# Altium project PLC_V1.0.PrjPcb
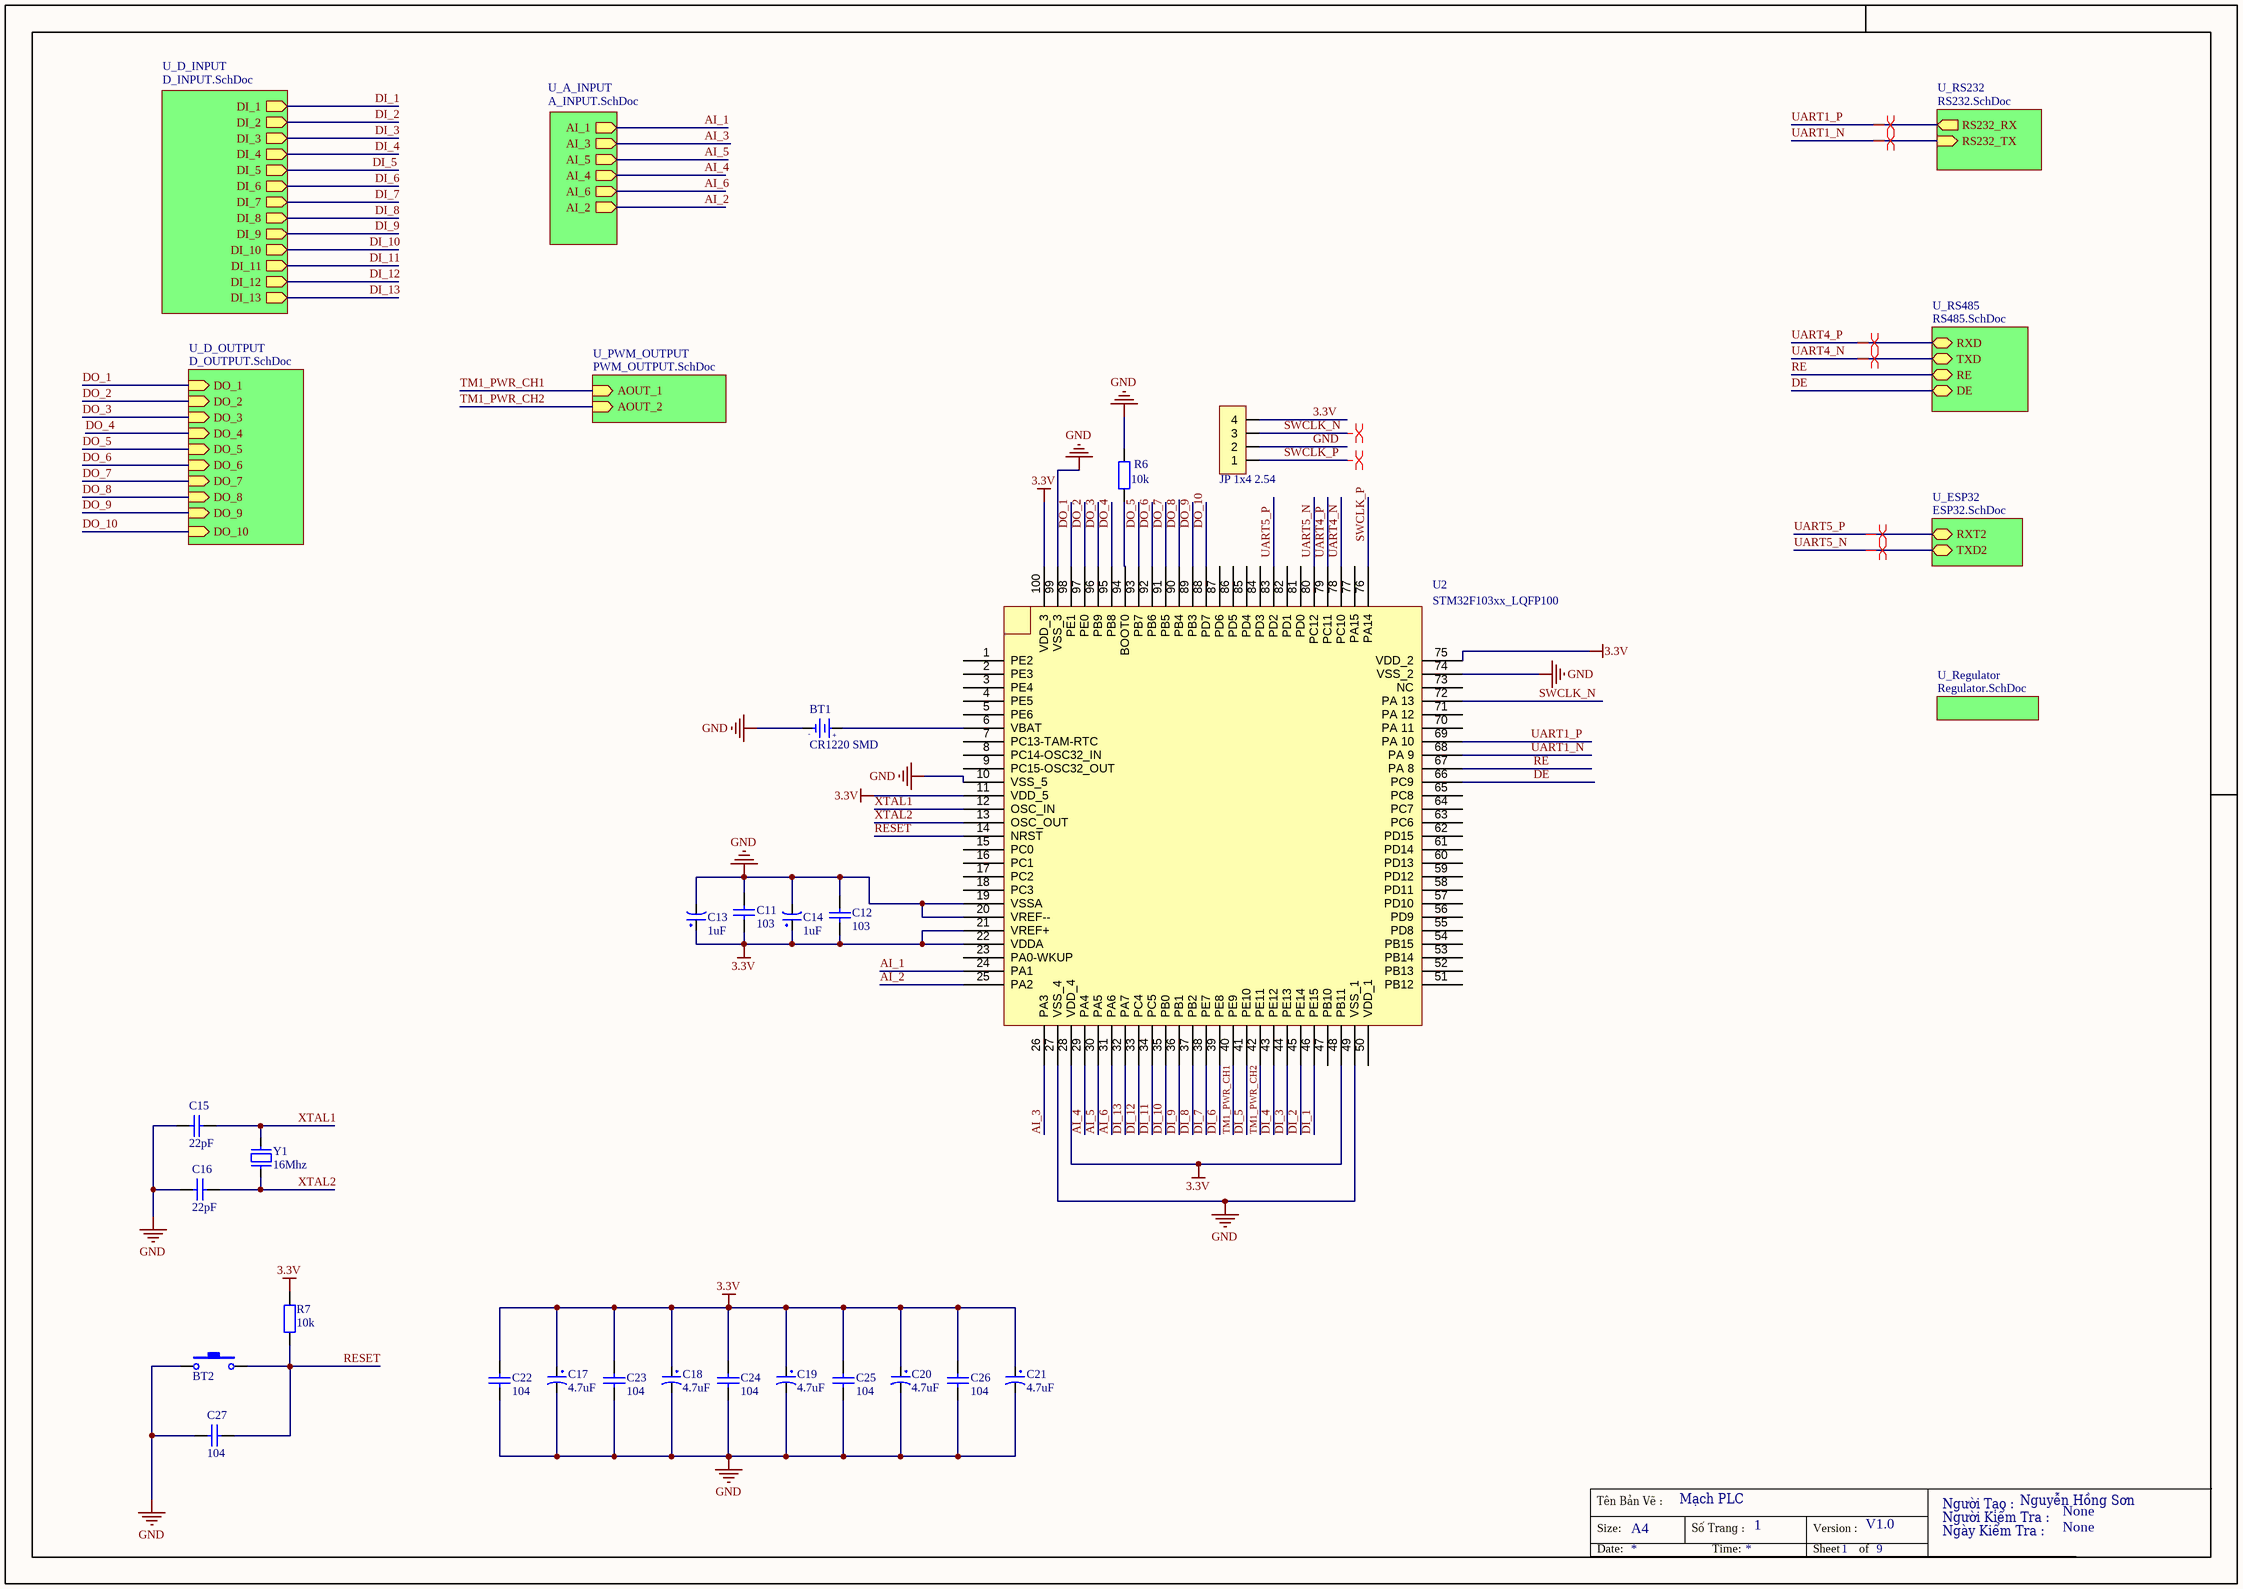
[diagram p0: PLC_V1.0.SchDoc]
9 sheets, 208 parts. Net scope: hierarchical (ports join the sheet entries above them; power ports are global).
Board file: PLC_V1.0.PcbDoc
Sheets:
  PLC_V1.0.SchDoc
    U_D_OUTPUT = D_OUTPUT.SchDoc
    U_RS485 = RS485.SchDoc
    U_D_INPUT = D_INPUT.SchDoc
    U_ESP32 = ESP32.SchDoc
    U_PWM_OUTPUT = PWM_OUTPUT.SchDoc
    U_A_INPUT = A_INPUT.SchDoc
    U_Regulator = Regulator.SchDoc
    U_RS232 = RS232.SchDoc

## Sheet PLC_V1.0.SchDoc: Mạch PLC
size 420 x 297 mm; SheetNumber: 1; SheetTotal: 9; Tên Bản Vẽ: Mạch PLC; Version: V1.0; Người Tạo: Nguyễn Hồng Sơn; Người Kiểm Tra: None; Ngày Kiểm Tra: None; Số Trang: 1

### Parts
BT1  CR1220 SMD  [DE PIN CR1220]
BT2  Nut Nhan 2 Chan SMD 3x6x2.5  [Nut Nhan 2 Chan SMD 3x6x2.5]  (value not drawn)
C11  103  [tu 0603]
C12  103  [tu 0603]
C13  1uF  [tu tantalum smd3216]
C14  1uF  [tu tantalum smd3216]
C15  22pF  [tu 0805]
C16  22pF  [tu 0805]
C17  4.7uF  [tu tantalum smd6032]
C18  4.7uF  [tu tantalum smd6032]
C19  4.7uF  [tu tantalum smd6032]
C20  4.7uF  [tu tantalum smd6032]
C21  4.7uF  [tu tantalum smd6032]
C22  104  [tu 0805]
C23  104  [tu 0805]
C24  104  [tu 0805]
C25  104  [tu 0805]
C26  104  [tu 0805]
C27  104  [tu 0805]
JP1  JP 1x4 2.54  [JP 1x4 DT]
R6  10k  [tro smd 0805]
R7  10k  [tro smd 0805]
U2  STM32F103xx_LQFP100  [STM32_LQFP100]
Y1  16Mhz  [Thach Anh 2 chan SMD]

### Sub-sheets
U_A_INPUT = A_INPUT.SchDoc: AI_1 (out), AI_3 (out), AI_5 (out), AI_4 (out), AI_6 (out), AI_2 (out)
U_D_INPUT = D_INPUT.SchDoc: DI_1 (out), DI_2 (out), DI_3 (out), DI_4 (out), DI_5 (out), DI_6 (out), DI_7 (out), DI_8 (out), DI_9 (out), DI_10 (out), DI_11 (out), DI_12 (out), DI_13 (out)
U_D_OUTPUT = D_OUTPUT.SchDoc: DO_1 (in), DO_2 (in), DO_3 (in), DO_4 (in), DO_5 (in), DO_6 (in), DO_7 (in), DO_8 (in), DO_9 (in), DO_10 (in)
U_ESP32 = ESP32.SchDoc: RXT2 (bidir), TXD2 (bidir)
U_PWM_OUTPUT = PWM_OUTPUT.SchDoc: AOUT_1 (in), AOUT_2 (in)
U_Regulator = Regulator.SchDoc: no entries
U_RS232 = RS232.SchDoc: RS232_RX (out), RS232_TX (in)
U_RS485 = RS485.SchDoc: RXD (bidir), TXD (bidir), RE (bidir), DE (bidir)

### Nets
3.3V: C11.1 C12.1 C13.1 C14.1 C17.1 C18.1 C19.1 C20.1 C21.1 C22.2 C23.2 C24.2 C25.2 C26.2 JP1.4 R7.1 U2.11(VDD_5) U2.21(VREF+) U2.22(VDDA) U2.28(VDD_4) U2.48(PB11) U2.75(VDD_2) U2.100(VDD_3)
GND: BT1.2(GND) BT2.1 C11.2 C12.2 C13.2 C14.2 C15.2 C16.2 C17.2 C18.2 C19.2 C20.2 C21.2 C22.1 C23.1 C24.1 C25.1 C26.1 C27.2 JP1.2 R6.2 U2.10(VSS_5) U2.19(VSSA) U2.20(VREF--) U2.27(VSS_4) U2.49(VSS_1) U2.74(VSS_2) U2.99(VSS_3)
AI_1: U2.24(PA1) ; sheet U_A_INPUT/AI_1
AI_2: U2.25(PA2) ; sheet U_A_INPUT/AI_2
AI_3: U2.26(PA3) ; sheet U_A_INPUT/AI_3
AI_4: U2.29(PA4) ; sheet U_A_INPUT/AI_4
AI_5: U2.30(PA5) ; sheet U_A_INPUT/AI_5
AI_6: U2.31(PA6) ; sheet U_A_INPUT/AI_6
DE: U2.66(PC9) ; sheet U_RS485/DE
DI_1: U2.46(PE15) ; sheet U_D_INPUT/DI_1
DI_2: U2.45(PE14) ; sheet U_D_INPUT/DI_2
DI_3: U2.44(PE13) ; sheet U_D_INPUT/DI_3
DI_4: U2.43(PE12) ; sheet U_D_INPUT/DI_4
DI_5: U2.41(PE10) ; sheet U_D_INPUT/DI_5
DI_6: U2.39(PE8) ; sheet U_D_INPUT/DI_6
DI_7: U2.38(PE7) ; sheet U_D_INPUT/DI_7
DI_8: U2.37(PB2) ; sheet U_D_INPUT/DI_8
DI_9: U2.36(PB1) ; sheet U_D_INPUT/DI_9
DI_10: U2.35(PB0) ; sheet U_D_INPUT/DI_10
DI_11: U2.34(PC5) ; sheet U_D_INPUT/DI_11
DI_12: U2.33(PC4) ; sheet U_D_INPUT/DI_12
DI_13: U2.32(PA7) ; sheet U_D_INPUT/DI_13
DO_1: U2.98(PE1) ; sheet U_D_OUTPUT/DO_1
DO_2: U2.97(PE0) ; sheet U_D_OUTPUT/DO_2
DO_3: U2.96(PB9) ; sheet U_D_OUTPUT/DO_3
DO_4: U2.95(PB8) ; sheet U_D_OUTPUT/DO_4
DO_5: U2.93(PB7) ; sheet U_D_OUTPUT/DO_5
DO_6: U2.92(PB6) ; sheet U_D_OUTPUT/DO_6
DO_7: U2.91(PB5) ; sheet U_D_OUTPUT/DO_7
DO_8: U2.90(PB4) ; sheet U_D_OUTPUT/DO_8
DO_9: U2.89(PB3) ; sheet U_D_OUTPUT/DO_9
DO_10: U2.88(PD7) ; sheet U_D_OUTPUT/DO_10
RE: U2.67(PA_8) ; sheet U_RS485/RE
RESET: BT2.2 C27.1 R7.2 U2.14(NRST)
SWCLK_N: JP1.3 U2.72(PA_13)
SWCLK_P: JP1.1 U2.76(PA14)
TM1_PWR_CH1: U2.40(PE9) ; sheet U_PWM_OUTPUT/AOUT_1
TM1_PWR_CH2: U2.42(PE11) ; sheet U_PWM_OUTPUT/AOUT_2
UART1_N: U2.68(PA_9) ; sheet U_RS232/RS232_TX
UART1_P: U2.69(PA_10) ; sheet U_RS232/RS232_RX
UART4_N: U2.78(PC10) ; sheet U_RS485/TXD
UART4_P: U2.79(PC11) ; sheet U_RS485/RXD
UART5_N: U2.80(PC12) ; sheet U_ESP32/TXD2
UART5_P: U2.83(PD2) ; sheet U_ESP32/RXT2
XTAL1: C15.1 U2.12(OSC_IN) Y1.2
XTAL2: C16.1 U2.13(OSC_OUT) Y1.1
NetBT1_1: BT1.1(+3V) U2.6(VBAT)
NetR6_1: R6.1 U2.94(BOOT0)

Not connected (* = marked no-connect by the designer): U2 1(PE2) 2(PE3) 3(PE4) 4(PE5) 5(PE6) 7(PC13-TAM-RTC) 8(PC14-OSC32_IN) 9(PC15-OSC32_OUT) 15(PC0) 16(PC1) 17(PC2) 18(PC3) 23(PA0-WKUP) 47(PB10) 50(VDD_1) 51(PB12) 52(PB13) 53(PB14) 54(PB15) 55(PD8) 56(PD9) 57(PD10) 58(PD11) 59(PD12) 60(PD13) 61(PD14) 62(PD15) 63(PC6) 64(PC7) 65(PC8) 70(PA_11) 71(PA_12) 73(NC) 77(PA15) 81(PD0) 82(PD1) 84(PD3) 85(PD4) 86(PD5) 87(PD6)

### Layout directives
differential pair: SWCLK_N, SWCLK_P, UART1_N, UART1_P, UART4_N, UART4_P, UART5_N, UART5_P

### Notes on the sheet
- Tên Bản Vẽ :
- Size:
- A4
- Số Trang :
- Version :
- Người Tạo :
- Người Kiểm Tra :
- Ngày Kiểm Tra :
- Date:
- Time:
- Sheet
- of
- (in symbol De pin CR1220 SMD) -; +

### Library data of the parts
BT1 = De pin CR1220 SMD: Ten: Đế PIN CR1220 SMD; Ma_Hang: MH000833
BT2 = Nut Nhan 2 Chan SMD 3x6x2.5: Ma_Hang: MH001036; Ten: Nút Nhấn 2 Chân 3x6x2.5MM SMD
C11 C12 = Tu 0603 103 50V 10%: Dán; Don_Vi: Con; So_Chan: 2; Ten_Linh_Kien: Tụ 0603 103-10nF 10% 50V; Ma_Hang: MH004567; Chung_Loai: Dán; Kieu_Chan: *
C13 C14 = Tu tantalum 1uF 25V SMD3216: Dán; Don_Vi: Con; So_Chan: 2; Ten_Linh_Kien: Tụ tantalum 105E-1uF 25V SMD3216; Ma_Hang: MH007472; Chung_Loai: Dán; Kieu_Chan: *
C15 C16 = Tu 0805 22pF 50V 10%: Dán; Don_Vi: Con; So_Chan: 2; Ten_Linh_Kien: Tụ 0805 22P 10% 50V; Ma_Hang: MH004560; Chung_Loai: Dán; Kieu_Chan: *
C17-C21 = Tu tantalum 4.7uF 35V SMD6032: Dán; Don_Vi: Con; So_Chan: 2; Ten_Linh_Kien: Tụ tantalum 475V-4.7uF 35V SMD6032; Ma_Hang: MH008687; Chung_Loai: Dán; Kieu_Chan: *
C22-C26 = Tu 0805 104 50V 10%: Dán 100nF; Don_Vi: Con; So_Chan: 2; Ten_Linh_Kien: Tụ 0805 104-100nF 10% 50V; Ma_Hang: MH004551; Chung_Loai: Dán; Kieu_Chan: *
  C22: Parameter 1: *
C27 = Tu 0805 104 50V 10%: Dán; Don_Vi: Con; So_Chan: 2; Ten_Linh_Kien: Tụ 0805 104-100nF 10% 50V; Ma_Hang: MH004551; Chung_Loai: Dán; Kieu_Chan: *
JP1 = JP 1x4 2.54 Duc Thang: Cắm; Ten_Linh_Kien: Jump Đơn Đực 2.54MM 1x40P Thẳng 11MM; Don_Vi: Con; Ma_Hang: MH000903; Ghi_Chu: *; Kieu_Chan: *; Chung_Loai: Cắm
R6 R7 = Tro 0805 5% 10k: Dán; Don_Vi: Con; So_Chan: 2; Ten_Linh_Kien: Trở 0805 5% 10k; Ma_Hang: MH005239; Chung_Loai: Dán; Kieu_Chan: *
Y1 = Thach Anh 2 chan SMD: Crystal For all Crystal 2pin.; Value: 4Mhz

## Sheet D_OUTPUT.SchDoc
size A; SheetNumber: 3; SheetTotal: 9
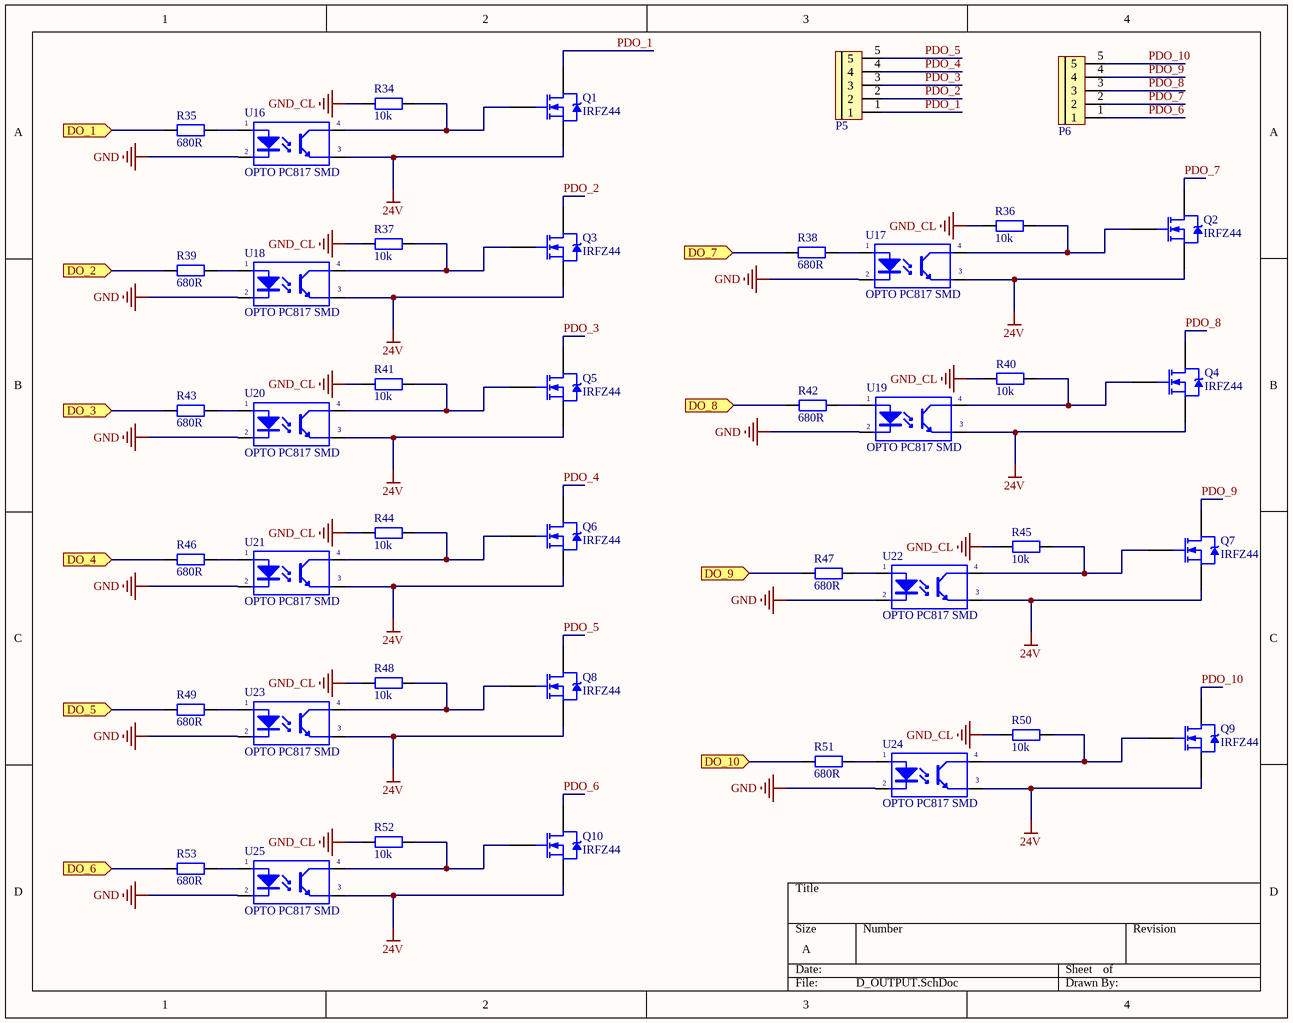
[diagram p1: D_OUTPUT.SchDoc]

### Parts
P5  CON 5 EDG5.08  [CON 5 5EDG5.08]  (value not drawn)
P6  CON 5 EDG5.08  [CON 5 5EDG5.08]  (value not drawn)
Q1  IRFZ44  [TO220]
Q2  IRFZ44  [TO220]
Q3  IRFZ44  [TO220]
Q4  IRFZ44  [TO220]
Q5  IRFZ44  [TO220]
Q6  IRFZ44  [TO220]
Q7  IRFZ44  [TO220]
Q8  IRFZ44  [TO220]
Q9  IRFZ44  [TO220]
Q10  IRFZ44  [TO220]
R34  10k  [tro smd 0805]
R35  680R  [Tro SMD 0805]
R36  10k  [tro smd 0805]
R37  10k  [tro smd 0805]
R38  680R  [Tro SMD 0805]
R39  680R  [Tro SMD 0805]
R40  10k  [tro smd 0805]
R41  10k  [tro smd 0805]
R42  680R  [Tro SMD 0805]
R43  680R  [Tro SMD 0805]
R44  10k  [tro smd 0805]
R45  10k  [tro smd 0805]
R46  680R  [Tro SMD 0805]
R47  680R  [Tro SMD 0805]
R48  10k  [tro smd 0805]
R49  680R  [Tro SMD 0805]
R50  10k  [tro smd 0805]
R51  680R  [Tro SMD 0805]
R52  10k  [tro smd 0805]
R53  680R  [Tro SMD 0805]
U16  OPTO PC817 SMD  [SOP4]
U17  OPTO PC817 SMD  [SOP4]
U18  OPTO PC817 SMD  [SOP4]
U19  OPTO PC817 SMD  [SOP4]
U20  OPTO PC817 SMD  [SOP4]
U21  OPTO PC817 SMD  [SOP4]
U22  OPTO PC817 SMD  [SOP4]
U23  OPTO PC817 SMD  [SOP4]
U24  OPTO PC817 SMD  [SOP4]
U25  OPTO PC817 SMD  [SOP4]

### Ports
DO_1 (in), DO_2 (in), DO_3 (in), DO_4 (in), DO_5 (in), DO_6 (in), DO_7 (in), DO_8 (in), DO_9 (in), DO_10 (in)

### Nets
24V: Q1.3(S) Q2.3(S) Q3.3(S) Q4.3(S) Q5.3(S) Q6.3(S) Q7.3(S) Q8.3(S) Q9.3(S) Q10.3(S) U16.3(E) U17.3(E) U18.3(E) U19.3(E) U20.3(E) U21.3(E) U22.3(E) U23.3(E) U24.3(E) U25.3(E)
GND: U16.2(K) U17.2(K) U18.2(K) U19.2(K) U20.2(K) U21.2(K) U22.2(K) U23.2(K) U24.2(K) U25.2(K)
GND_CL: R34.1 R36.1 R37.1 R40.1 R41.1 R44.1 R45.1 R48.1 R50.1 R52.1
DO_1: R35.1 ; port DO_1
DO_2: R39.1 ; port DO_2
DO_3: R43.1 ; port DO_3
DO_4: R46.1 ; port DO_4
DO_5: R49.1 ; port DO_5
DO_6: R53.1 ; port DO_6
DO_7: R38.1 ; port DO_7
DO_8: R42.1 ; port DO_8
DO_9: R47.1 ; port DO_9
DO_10: R51.1 ; port DO_10
PDO_1: P5.1 Q1.2(D)
PDO_2: P5.2 Q3.2(D)
PDO_3: P5.3 Q5.2(D)
PDO_4: P5.4 Q6.2(D)
PDO_5: P5.5 Q8.2(D)
PDO_6: P6.1 Q10.2(D)
PDO_7: P6.2 Q2.2(D)
PDO_8: P6.3 Q4.2(D)
PDO_9: P6.4 Q7.2(D)
PDO_10: P6.5 Q9.2(D)
NetQ1_1: Q1.1(G) R34.2 U16.4(C)
NetQ2_1: Q2.1(G) R36.2 U17.4(C)
NetQ3_1: Q3.1(G) R37.2 U18.4(C)
NetQ4_1: Q4.1(G) R40.2 U19.4(C)
NetQ5_1: Q5.1(G) R41.2 U20.4(C)
NetQ6_1: Q6.1(G) R44.2 U21.4(C)
NetQ7_1: Q7.1(G) R45.2 U22.4(C)
NetQ8_1: Q8.1(G) R48.2 U23.4(C)
NetQ9_1: Q9.1(G) R50.2 U24.4(C)
NetQ10_1: Q10.1(G) R52.2 U25.4(C)
NetR35_2: R35.2 U16.1(A)
NetR38_2: R38.2 U17.1(A)
NetR39_2: R39.2 U18.1(A)
NetR42_2: R42.2 U19.1(A)
NetR43_2: R43.2 U20.1(A)
NetR46_2: R46.2 U21.1(A)
NetR47_2: R47.2 U22.1(A)
NetR49_2: R49.2 U23.1(A)
NetR51_2: R51.2 U24.1(A)
NetR53_2: R53.2 U25.1(A)

### Library data of the parts
P5 P6 = CON 5 EDG5.08: Cắm; Ten_Linh_Kien: CON 5 2EDG5.08-5P 5.08MM ( Xanh Cong); Ma_Hang: MH003589; Kieu_Chan: *; Don_Vi: Con; Ghi_Chu: *; Chung_Loai: Cắm
Q1-Q10 = IRFZ44 DIP: N-Channel Power MOSFET
R34 R36 R37 R40 R41 R44 R45 R48 R50 R52 = Tro 0805 5% 10k: as R6 on sheet PLC_V1.0; Chung_Loai: Dán; Kieu_Chan: *
R35 R38 R39 R42 R43 R46 R47 R49 R51 R53 = Tro 0805 5% 680R: Dán; Don_Vi: Con; Ma_Hang: MH005344; So_Chan: 2; Ten_Linh_Kien: Trở 0805 5% 680R; Chung_Loai: Dán; Kieu_Chan: *
U16-U25 = OPTO PC817 SMD: Single Opto; Value: PC817

## Sheet RS485.SchDoc
size A; SheetNumber: 7; SheetTotal: 9
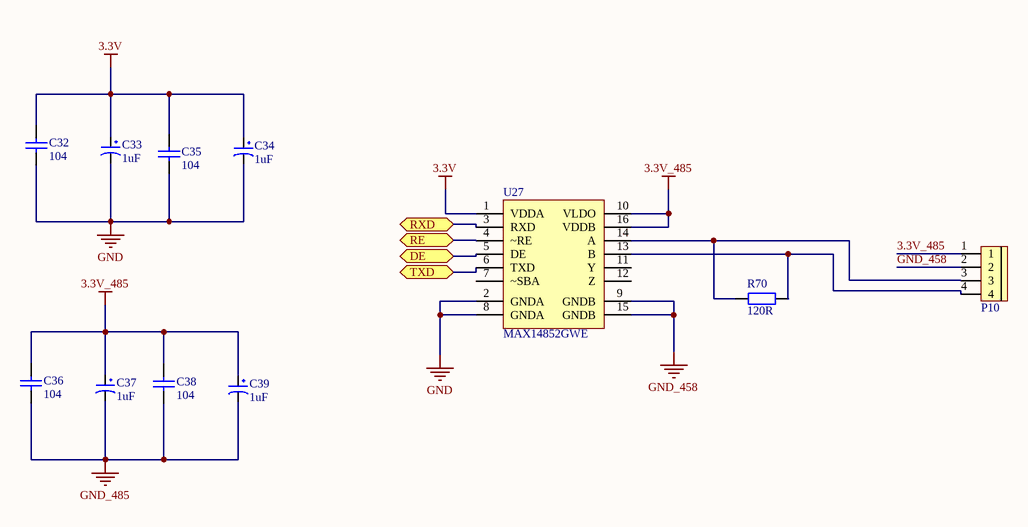
[diagram p2: RS485.SchDoc]

### Parts
C32  104  [tu 0805]
C33  1uF  [tu tantalum smd6032]
C34  1uF  [tu tantalum smd6032]
C35  104  [tu 0805]
C36  104  [tu 0805]
C37  1uF  [tu tantalum smd6032]
C38  104  [tu 0805]
C39  1uF  [tu tantalum smd6032]
P10  CON 4 EDG5.08  [CON 4 4EDG5.08]  (value not drawn)
R70  120R  [tro smd 0805]
U27  MAX14852GWE  [SOICW16_50_440_25X76_SMT]

### Ports
DE (bidir), RE (bidir), RXD (bidir), TXD (bidir)

### Nets
3.3V: C32.1 C33.1 C34.1 C35.1 U27.1(VDDA)
3.3V_485: C36.1 C37.1 C38.1 C39.1 P10.1 U27.10(VLDO) U27.16(VDDB)
GND: C32.2 C33.2 C34.2 C35.2 U27.2(GNDA) U27.8(GNDA)
GND_458: P10.2 U27.9(GNDB) U27.15(GNDB)
GND_485: C36.2 C37.2 C38.2 C39.2
DE: U27.5(DE) ; port DE
RE: U27.4(~RE) ; port RE
UART4_N: U27.6(TXD) ; port TXD
UART4_P: U27.3(RXD) ; port RXD
NetP10_3: P10.3 R70.1 U27.14(A)
NetP10_4: P10.4 R70.2 U27.13(B)

Not connected (* = marked no-connect by the designer): U27 7(~SBA) 11(Y) 12(Z)

### Library data of the parts
C32 C35 C36 C38 = Tu 0805 104 50V 10%: as C27 on sheet PLC_V1.0; Chung_Loai: Dán; Kieu_Chan: *
C33 C34 C37 C39 = Tu tantalum 1uF 50V SMD6032: Dán; Don_Vi: Con; So_Chan: 2; Ten_Linh_Kien: Tụ tantalum 105T-1uF 50V SMD6032; Ma_Hang: MH008400; Chung_Loai: Dán; Kieu_Chan: *
P10 = CON 4 EDG5.08: Cắm; Ten_Linh_Kien: CON 4 2EDG5.08-4P 5.08MM ( Xanh Cong); Ma_Hang: MH000979; Don_Vi: Con; Ghi_Chu: *; Kieu_Chan: *; Chung_Loai: Cắm
R70 = Tro 0805 5% 120R: Dán; Don_Vi: Con; So_Chan: 2; Ten_Linh_Kien: Trở 0805 5% 120R; Ma_Hang: MH005253; Chung_Loai: Dán; Kieu_Chan: *
U27 = IC_MAX14852GWE: 1/1 Transceiver Full RS422, RS485 16-SOIC; Manufacturer: Maxim; Manufacturer Part Number: MAX14852GWE+T; Alternate Part Number-1: NA; Case/Package: SOICW16; Supplier-1: Mouser; Supplier Part Number-1: 700-MAX14852GWE+T

## Sheet D_INPUT.SchDoc
size A; SheetNumber: 2; SheetTotal: 9
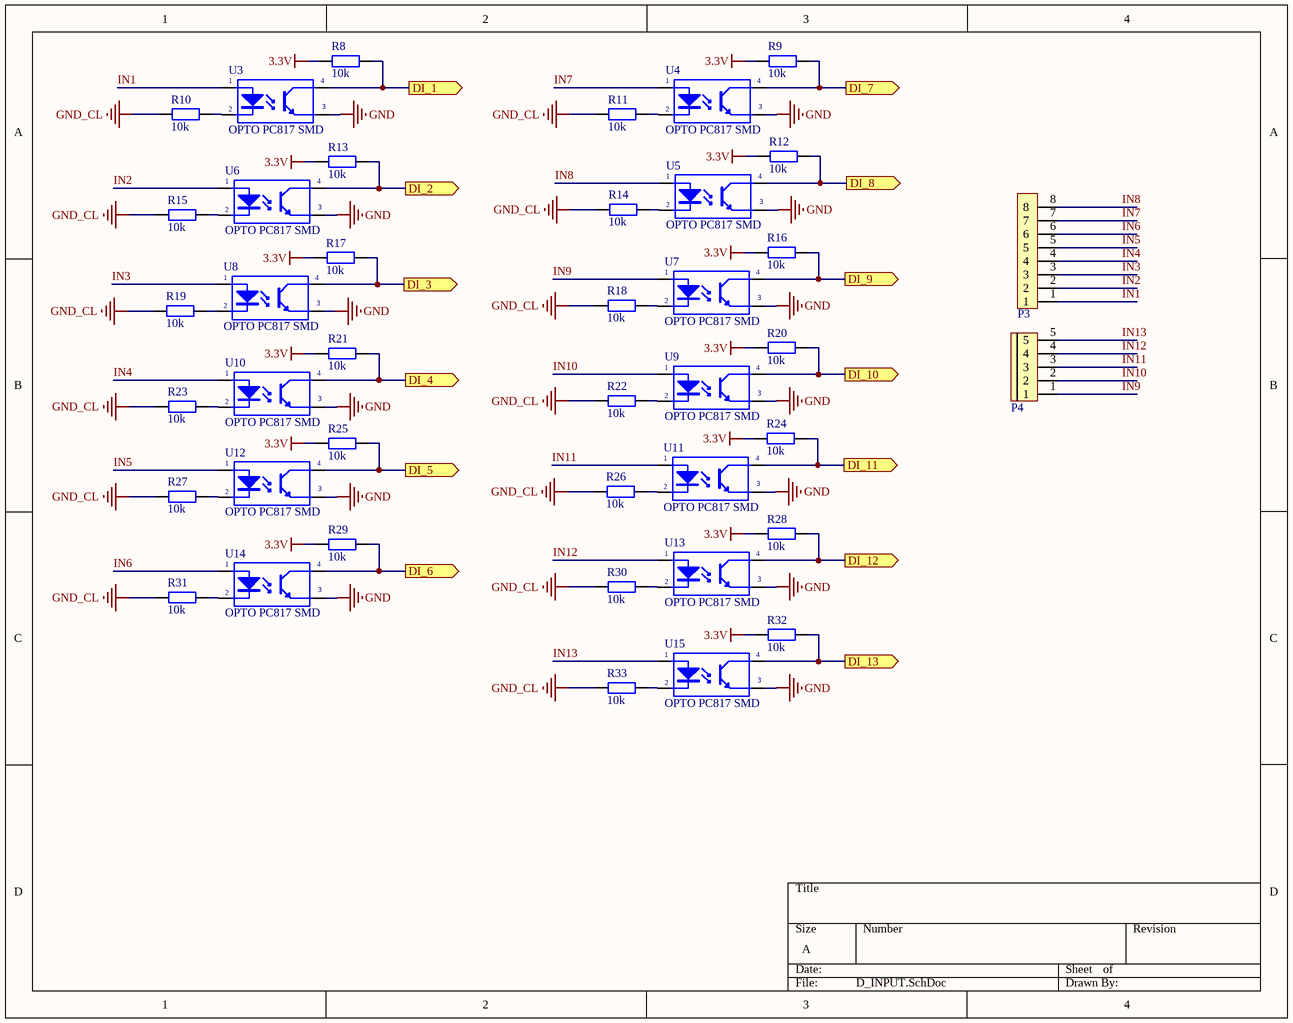
[diagram p3: D_INPUT.SchDoc]

### Parts
P3  CON 8 EDG5.08  [CON 8 8EDG5.08]  (value not drawn)
P4  CON 5 EDG5.08  [CON 5 5EDG5.08]  (value not drawn)
R8  10k  [tro smd 0805]
R9  10k  [tro smd 0805]
R10  10k  [tro smd 0805]
R11  10k  [tro smd 0805]
R12  10k  [tro smd 0805]
R13  10k  [tro smd 0805]
R14  10k  [tro smd 0805]
R15  10k  [tro smd 0805]
R16  10k  [tro smd 0805]
R17  10k  [tro smd 0805]
R18  10k  [tro smd 0805]
R19  10k  [tro smd 0805]
R20  10k  [tro smd 0805]
R21  10k  [tro smd 0805]
R22  10k  [tro smd 0805]
R23  10k  [tro smd 0805]
R24  10k  [tro smd 0805]
R25  10k  [tro smd 0805]
R26  10k  [tro smd 0805]
R27  10k  [tro smd 0805]
R28  10k  [tro smd 0805]
R29  10k  [tro smd 0805]
R30  10k  [tro smd 0805]
R31  10k  [tro smd 0805]
R32  10k  [tro smd 0805]
R33  10k  [tro smd 0805]
U3  OPTO PC817 SMD  [SOP4]
U4  OPTO PC817 SMD  [SOP4]
U5  OPTO PC817 SMD  [SOP4]
U6  OPTO PC817 SMD  [SOP4]
U7  OPTO PC817 SMD  [SOP4]
U8  OPTO PC817 SMD  [SOP4]
U9  OPTO PC817 SMD  [SOP4]
U10  OPTO PC817 SMD  [SOP4]
U11  OPTO PC817 SMD  [SOP4]
U12  OPTO PC817 SMD  [SOP4]
U13  OPTO PC817 SMD  [SOP4]
U14  OPTO PC817 SMD  [SOP4]
U15  OPTO PC817 SMD  [SOP4]

### Ports
DI_1 (out), DI_2 (out), DI_3 (out), DI_4 (out), DI_5 (out), DI_6 (out), DI_7 (out), DI_8 (out), DI_9 (out), DI_10 (out), DI_11 (out), DI_12 (out), DI_13 (out)

### Nets
3.3V: R8.2 R9.2 R12.2 R13.2 R16.2 R17.2 R20.2 R21.2 R24.2 R25.2 R28.2 R29.2 R32.2
GND: U3.3(E) U4.3(E) U5.3(E) U6.3(E) U7.3(E) U8.3(E) U9.3(E) U10.3(E) U11.3(E) U12.3(E) U13.3(E) U14.3(E) U15.3(E)
GND_CL: R10.2 R11.2 R14.2 R15.2 R18.2 R19.2 R22.2 R23.2 R26.2 R27.2 R30.2 R31.2 R33.2
DI_1: R8.1 U3.4(C) ; port DI_1
DI_2: R13.1 U6.4(C) ; port DI_2
DI_3: R17.1 U8.4(C) ; port DI_3
DI_4: R21.1 U10.4(C) ; port DI_4
DI_5: R25.1 U12.4(C) ; port DI_5
DI_6: R29.1 U14.4(C) ; port DI_6
DI_7: R9.1 U4.4(C) ; port DI_7
DI_8: R12.1 U5.4(C) ; port DI_8
DI_9: R16.1 U7.4(C) ; port DI_9
DI_10: R20.1 U9.4(C) ; port DI_10
DI_11: R24.1 U11.4(C) ; port DI_11
DI_12: R28.1 U13.4(C) ; port DI_12
DI_13: R32.1 U15.4(C) ; port DI_13
IN1: P3.1 U3.1(A)
IN2: P3.2 U6.1(A)
IN3: P3.3 U8.1(A)
IN4: P3.4 U10.1(A)
IN5: P3.5 U12.1(A)
IN6: P3.6 U14.1(A)
IN7: P3.7 U4.1(A)
IN8: P3.8 U5.1(A)
IN9: P4.1 U7.1(A)
IN10: P4.2 U9.1(A)
IN11: P4.3 U11.1(A)
IN12: P4.4 U13.1(A)
IN13: P4.5 U15.1(A)
NetR10_1: R10.1 U3.2(K)
NetR11_1: R11.1 U4.2(K)
NetR14_1: R14.1 U5.2(K)
NetR15_1: R15.1 U6.2(K)
NetR18_1: R18.1 U7.2(K)
NetR19_1: R19.1 U8.2(K)
NetR22_1: R22.1 U9.2(K)
NetR23_1: R23.1 U10.2(K)
NetR26_1: R26.1 U11.2(K)
NetR27_1: R27.1 U12.2(K)
NetR30_1: R30.1 U13.2(K)
NetR31_1: R31.1 U14.2(K)
NetR33_1: R33.1 U15.2(K)

### Library data of the parts
P3 = CON 8 EDG5.08: Cắm; Ten_Linh_Kien: CON 8 2EDG5.08-8P 5.08MM ( Xanh Cong); Ma_Hang: MH000978; Don_Vi: Con; Ghi_Chu: *; Kieu_Chan: *; Chung_Loai: Cắm
P4 = CON 5 EDG5.08: as P5 on sheet D_OUTPUT; Kieu_Chan: *; Don_Vi: Con; Ghi_Chu: *; Chung_Loai: Cắm
R8-R33 = Tro 0805 5% 10k: as R6 on sheet PLC_V1.0; Chung_Loai: Dán; Kieu_Chan: *
U3-U15 = OPTO PC817 SMD: Single Opto; Value: PC817

## Sheet ESP32.SchDoc
size A; SheetNumber: 8; SheetTotal: 9
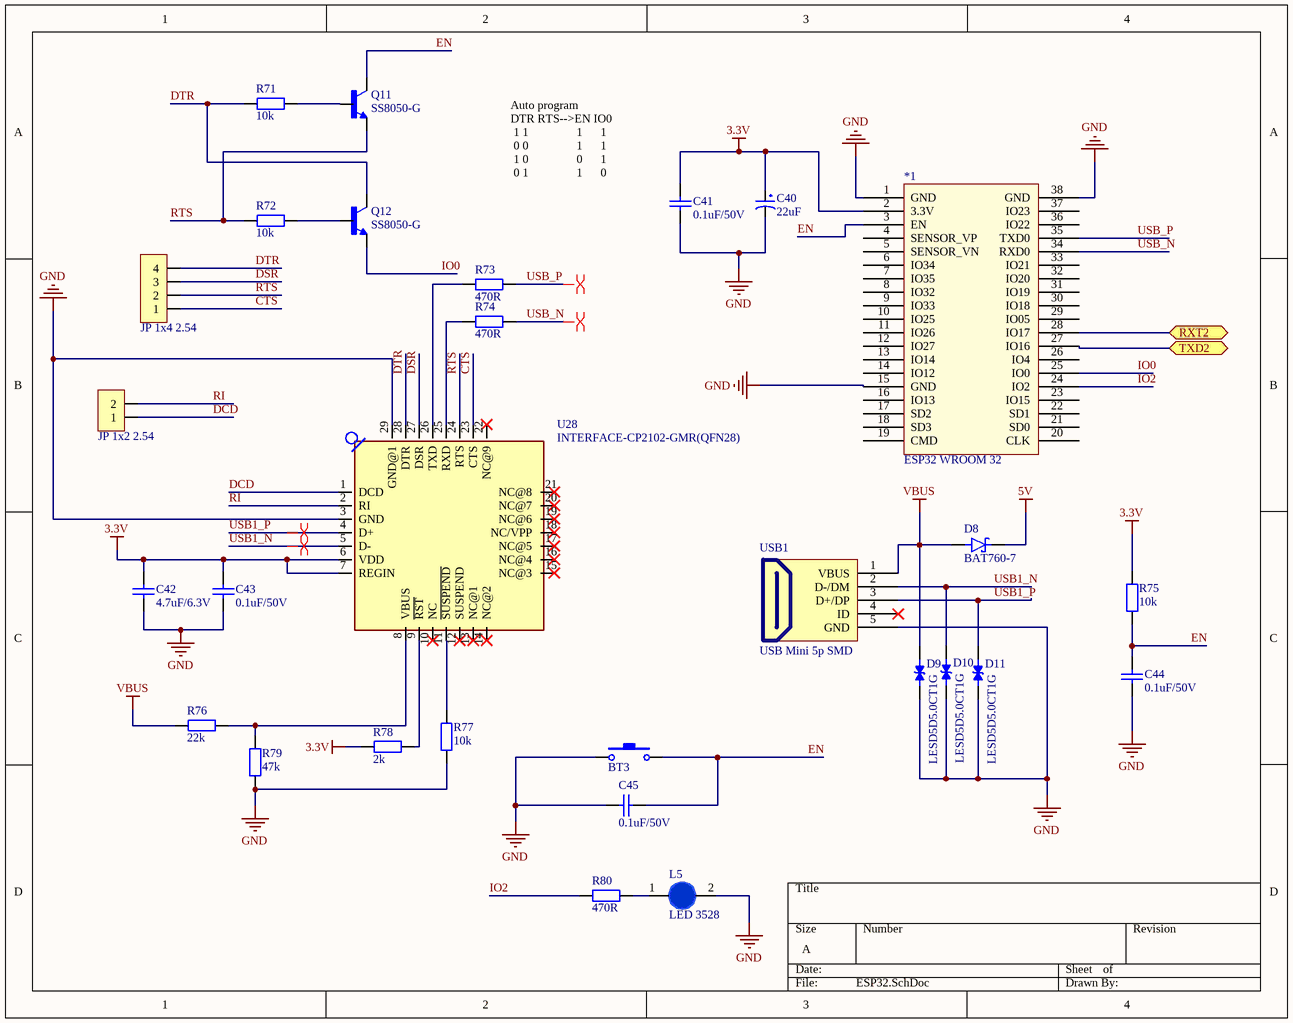
[diagram p4: ESP32.SchDoc]

### Parts
*1  ESP32 WROOM 32  [ESP32-WROOM-32D]
BT3  Nut Nhan 2 Chan SMD 3x6x2.5  [Nut Nhan 2 Chan SMD 3x6x2.5]  (value not drawn)
C40  22uF  [tu tantalum smd7343]
C41  0.1uF/50V  [tu 0805]
C42  4.7uF/6.3V  [tu 0805]
C43  0.1uF/50V  [tu 0805]
C44  0.1uF/50V  [tu 0805]
C45  0.1uF/50V  [tu 0805]
D8  BAT760-7  [SOD2513X120N]
D9  LESD5D5.0CT1G  [TVS_LESD5D5.0CT1G]
D10  LESD5D5.0CT1G  [TVS_LESD5D5.0CT1G]
D11  LESD5D5.0CT1G  [TVS_LESD5D5.0CT1G]
JP2  JP 1x4 2.54  [JP 1x4 DT]
JP3  JP 1x2 2.54  [JP 1x2 DT]
L5  LED 3528  [LED-3528-BLUE]
Q11  SS8050-G  [TRANS_SS8050-G]
Q12  SS8050-G  [TRANS_SS8050-G]
R71  10k  [tro smd 0805]
R72  10k  [tro smd 0805]
R73  470R  [Tro SMD 0805]
R74  470R  [Tro SMD 0805]
R75  10k  [tro smd 0805]
R76  22k  [tro smd 0805]
R77  10k  [tro smd 0805]
R78  2k  [Tro SMD 0805]
R79  47k  [tro smd 0805]
R80  470R  [Tro SMD 0805]
U28  INTERFACE-CP2102-GMR(QFN28)  [QFN28G_0.5-5X5MM]
USB1  USB Mini 5p SMD  [USB Mini 5p SMD]

### Ports
RXT2 (bidir), TXD2 (bidir)

### Nets
3.3V: *1.2(3.3V) C40.1 C41.2 C42.1 C43.1 R75.2 R78.1 U28.6(VDD) U28.7(REGIN)
5V: D8.C(K)
GND: *1.1(GND) *1.15(GND) *1.38(GND) BT3.1 C40.2 C41.1 C42.2 C43.2 C44.1 C45.2 D9.2 D10.2 D11.2 L5.2(K) R77.1 R79.2 U28.3(GND) U28.29(GND@1) USB1.5(GND)
VBUS: D8.A D9.1 R76.1 USB1.1(VBUS)
CTS: JP2.1 U28.23(CTS)
DCD: JP3.1 U28.1(DCD)
DSR: JP2.3 U28.27(DSR)
DTR: JP2.4 Q12.3(C) R71.1 U28.28(DTR)
EN: *1.3(EN) BT3.2 C44.2 C45.1 Q11.3(C) R75.1
IO0: *1.25(IO0) Q12.2(E)
IO2: *1.24(IO2) R80.1
RI: JP3.2 U28.2(RI)
RTS: JP2.2 Q11.2(E) R72.1 U28.24(RTS)
UART5_N: *1.27(IO16) ; port TXD2
UART5_P: *1.28(IO17) ; port RXT2
USB1_N: D10.1 U28.5(D-) USB1.2(D-/DM)
USB1_P: D11.1 U28.4(D+) USB1.3(D+/DP)
USB_N: *1.34(RXD0) R74.2
USB_P: *1.35(TXD0) R73.2
NetL5_1: L5.1(A) R80.2
NetQ11_1: Q11.1(B) R71.2
NetQ12_1: Q12.1(B) R72.2
NetR73_1: R73.1 U28.26(TXD)
NetR74_1: R74.1 U28.25(RXD)
NetR76_2: R76.2 R79.1 U28.8(VBUS)
NetR77_2: R77.2 U28.11(~{SUSPEND})
NetR78_2: R78.2 U28.9(~{RST})

Not connected (* = marked no-connect by the designer): *1 4(SENSOR_VP) 5(SENSOR_VN) 6(IO34) 7(IO35) 8(IO32) 9(IO33) 10(IO25) 11(IO26) 12(IO27) 13(IO14) 14(IO12) 16(IO13) 17(SD2) 18(SD3) 19(CMD) 20(CLK) 21(SD0) 22(SD1) 23(IO15) 26(IO4) 29(IO05) 30(IO18) 31(IO19) 32(IO20) 33(IO21) 36(IO22) 37(IO23); U28 10(NC)* 12(SUSPEND)* 13(NC@1)* 14(NC@2)* 15(NC@3)* 16(NC@4)* 17(NC@5)* 18(NC/VPP)* 19(NC@6)* 20(NC@7)* 21(NC@8)* 22(NC@9)*; USB1 4(ID)*

### Layout directives
differential pair: USB1_N, USB1_P, USB_N, USB_P

### Notes on the sheet
- Auto program
  DTR RTS-->EN IO0
  1 1                1      1
  0 0                1      1
  1 0                0      1
  0 1                1      0

### Library data of the parts
BT3 = Nut Nhan 2 Chan SMD 3x6x2.5: as BT2 on sheet PLC_V1.0
C40 = Tu tantalum 22uF 25V SMD7343: Dán; Don_Vi: Con; So_Chan: 2; Ten_Linh_Kien: Tụ tantalum 226E-22uF 25V SMD7343; Ma_Hang: MH007975; Chung_Loai: Dán; Kieu_Chan: *
C41-C45 = Tu 0805 104 50V 10%: as C27 on sheet PLC_V1.0; Chung_Loai: Dán; Kieu_Chan: *
D8 = BAT760-7: Diode Schottky 30V 1A 2-Pin SOD-323 T/R; MF: Diodes Zetex; MP: BAT760-7; SnapEDA_Link: https://www.snapeda.com/parts/BAT760-7/Zetex/view-part/4817231/?ref=snap; Value: *; DigiKey-Purchase-URL: https://snapeda.com/shop?store=DigiKey&id=4817231; Package: None; Mouser-Purchase-URL: https://snapeda.com/shop?store=Mouser&id=4817231; Price: None; Availability: Good
D9-D11 = LESD5D5.0CT1G: Transient Voltage Suppressors for ESD Protection; MF: Leshan Radio Co.; Check_prices: https://www.snapeda.com/parts/LESD5D5.0CT1G/Leshan+Radio+Co./view-part/?ref=eda; Value: *; Availability: Not in stock; Package: None; SnapEDA_Link: https://www.snapeda.com/parts/LESD5D5.0CT1G/Leshan+Radio+Co./view-part/?ref=snap; MP: LESD5D5.0CT1G; Price: None
JP2 = JP 1x4 2.54 Duc Thang: as JP1 on sheet PLC_V1.0; Ghi_Chu: *; Kieu_Chan: *; Chung_Loai: Cắm
JP3 = JP 1x2 2.54 Duc Thang: Cắm; Ten_Linh_Kien: Jump Đơn Đực 2.54MM 1x40P Thẳng 11MM; Don_Vi: Con; Ma_Hang: MH000903; Ghi_Chu: *; Kieu_Chan: *; Chung_Loai: Cắm
L5 = LED 3528 Xanh Duong: Dán; Don_Vi: Con; Ma_Hang: MH005546; Ten_Linh_Kien: LED3528 Màu Xanh Dương; Ghi_Chu: *; Kieu_Chan: *; Chung_Loai: Dán
Q11 Q12 = SS8050-G: Bipolar (BJT) Transistor NPN 25 V 1.5 A 100MHz 300 mW Surface Mount SOT-23-3; MP: SS8050G; MF: Comchip; Digi-Key_Part_Number: 641-1790-2-ND; Check_prices: https://www.snapeda.com/parts/SS8050G/Comchip/view-part/?ref=eda; Package: None; SnapEDA_Link: https://www.snapeda.com/parts/SS8050G/Comchip/view-part/?ref=snap; Value: *
R71 R72 R75 R77 = Tro 0805 5% 10k: as R6 on sheet PLC_V1.0; Chung_Loai: Dán; Kieu_Chan: *
R73 R74 R80 = Tro 0805 5% 470R: Dán; Don_Vi: Con; Ma_Hang: MH005341; Ten_Linh_Kien: Trở 0805 5% 470R; So_Chan: 2; Chung_Loai: Dán; Kieu_Chan: *
R76 = Tro 0805 5% 22k: Dán; Don_Vi: Con; So_Chan: 2; Ten_Linh_Kien: Trở 0805 5% 22k; Ma_Hang: MH005248; Chung_Loai: Dán; Kieu_Chan: *
R78 = Tro 0805 5% 2k: Dán; Don_Vi: Con; So_Chan: 2; Ten_Linh_Kien: Trở 0805 5% 2k; Ma_Hang: MH005304; Chung_Loai: Dán; Kieu_Chan: *
R79 = Tro 0805 5% 47k: Dán; Don_Vi: Con; So_Chan: 2; Ten_Linh_Kien: Trở 0805 5% 47k; Ma_Hang: MH005320; Chung_Loai: Dán; Kieu_Chan: *
U28 = INTERFACE-CP2102-GMR(QFN28): USB Bridge, USB to UART USB 2.0 UART Interface 28-QFN (5x5); MF: Silicon; Price: None; Availability: In Stock; MP: CP2102-GMR; Package: VFQFN-28 Vishay Siliconix; SnapEDA_Link: https://www.snapeda.com/parts/CP2102-GMR/Silicon+Labs/view-part/?ref=snap; Check_prices: https://www.snapeda.com/parts/CP2102-GMR/Silicon+Labs/view-part/?ref=eda; Value: *; Purchase-URL: https://pricing.snapeda.com/search/part/CP2102-GMR/?ref=eda
USB1 = USB Mini 5p SMD: USB Type B; Ten: MiniUSB 5P SMD; Ma_Hang: MH001022

## Sheet PWM_OUTPUT.SchDoc
size A; SheetNumber: 4; SheetTotal: 9
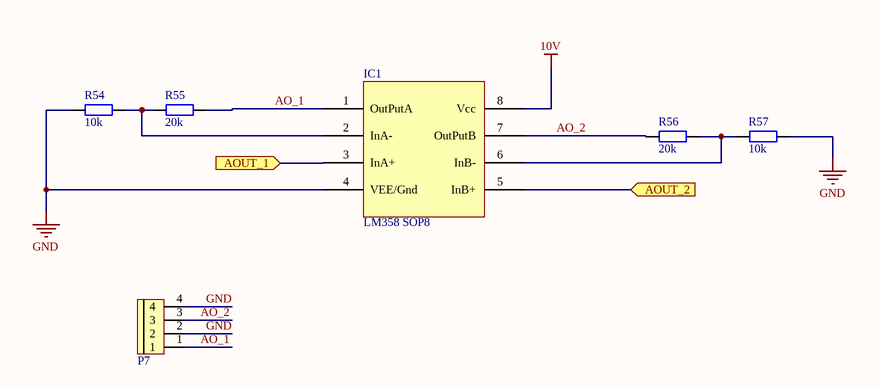
[diagram p5: PWM_OUTPUT.SchDoc]

### Parts
IC1  LM358 SOP8  [SOP 8]
P7  CON 4 EDG5.08  [CON 4 4EDG5.08]  (value not drawn)
R54  10k  [tro smd 0805]
R55  20k  [tro smd 0805]
R56  20k  [tro smd 0805]
R57  10k  [tro smd 0805]

### Ports
AOUT_1 (in), AOUT_2 (in)

### Nets
10V: IC1.8(Vcc)
GND: IC1.4(VEE/Gnd) P7.2 P7.4 R54.1 R57.2
AO_1: IC1.1(OutPutA) P7.1 R55.2
AO_2: IC1.7(OutPutB) P7.3 R56.1
TM1_PWR_CH1: IC1.3(InA+) ; port AOUT_1
TM1_PWR_CH2: IC1.5(InB+) ; port AOUT_2
NetIC1_2: IC1.2(InA-) R54.2 R55.1
NetIC1_6: IC1.6(InB-) R56.2 R57.1

### Library data of the parts
IC1 = LM358 SOP8: Dán; Ma_Hang: MH000609; Don_Vi: Con; Ten_Linh_Kien: LM358 SOP8; Kieu_Chan: *; Ghi_Chu: *; Chung_Loai: Dán
P7 = CON 4 EDG5.08: as P10 on sheet RS485; Don_Vi: Con; Ghi_Chu: *; Kieu_Chan: *; Chung_Loai: Cắm
R54 R57 = Tro 0805 5% 10k: as R6 on sheet PLC_V1.0; Chung_Loai: Dán; Kieu_Chan: *
R55 R56 = Tro 0805 5% 20k: Dán; Don_Vi: Con; So_Chan: 2; Ten_Linh_Kien: Trở 0805 5% 20k; Ma_Hang: MH005247; Chung_Loai: Dán; Kieu_Chan: *

## Sheet A_INPUT.SchDoc
size A; SheetNumber: 5; SheetTotal: 9
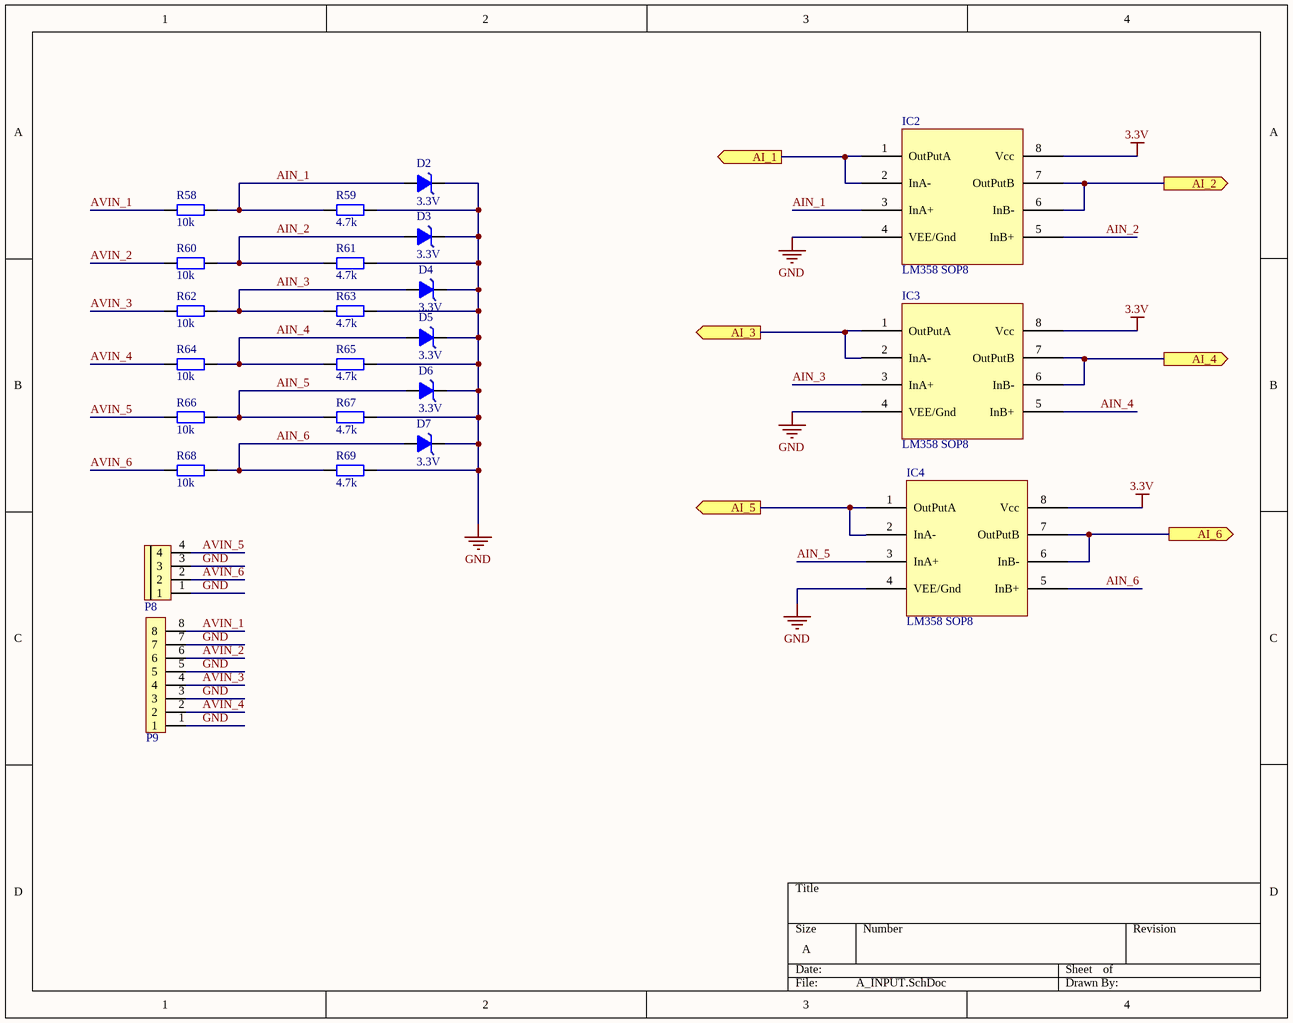
[diagram p6: A_INPUT.SchDoc]

### Parts
D2  3.3V  [DIODE ZENNER SMD SOD80]
D3  3.3V  [DIODE ZENNER SMD SOD80]
D4  3.3V  [DIODE ZENNER SMD SOD80]
D5  3.3V  [DIODE ZENNER SMD SOD80]
D6  3.3V  [DIODE ZENNER SMD SOD80]
D7  3.3V  [DIODE ZENNER SMD SOD80]
IC2  LM358 SOP8  [SOP 8]
IC3  LM358 SOP8  [SOP 8]
IC4  LM358 SOP8  [SOP 8]
P8  CON 4 EDG5.08  [CON 4 4EDG5.08]  (value not drawn)
P9  CON 8 EDG5.08  [CON 8 8EDG5.08]  (value not drawn)
R58  10k  [tro smd 0805]
R59  4.7k  [tro smd 0805]
R60  10k  [tro smd 0805]
R61  4.7k  [tro smd 0805]
R62  10k  [tro smd 0805]
R63  4.7k  [tro smd 0805]
R64  10k  [tro smd 0805]
R65  4.7k  [tro smd 0805]
R66  10k  [tro smd 0805]
R67  4.7k  [tro smd 0805]
R68  10k  [tro smd 0805]
R69  4.7k  [tro smd 0805]

### Ports
AI_1 (out), AI_2 (out), AI_3 (out), AI_4 (out), AI_5 (out), AI_6 (out)

### Nets
3.3V: IC2.8(Vcc) IC3.8(Vcc) IC4.8(Vcc)
GND: D2.2(K) D3.2(K) D4.2(K) D5.2(K) D6.2(K) D7.2(K) IC2.4(VEE/Gnd) IC3.4(VEE/Gnd) IC4.4(VEE/Gnd) P8.1 P8.3 P9.1 P9.3 P9.5 P9.7 R59.1 R61.1 R63.1 R65.1 R67.1 R69.1
AI_1: IC2.1(OutPutA) IC2.2(InA-) ; port AI_1
AI_2: IC2.6(InB-) IC2.7(OutPutB) ; port AI_2
AI_3: IC3.1(OutPutA) IC3.2(InA-) ; port AI_3
AI_4: IC3.6(InB-) IC3.7(OutPutB) ; port AI_4
AI_5: IC4.1(OutPutA) IC4.2(InA-) ; port AI_5
AI_6: IC4.6(InB-) IC4.7(OutPutB) ; port AI_6
AIN_1: D2.1(A) IC2.3(InA+) R58.1 R59.2
AIN_2: D3.1(A) IC2.5(InB+) R60.1 R61.2
AIN_3: D4.1(A) IC3.3(InA+) R62.1 R63.2
AIN_4: D5.1(A) IC3.5(InB+) R64.1 R65.2
AIN_5: D6.1(A) IC4.3(InA+) R66.1 R67.2
AIN_6: D7.1(A) IC4.5(InB+) R68.1 R69.2
AVIN_1: P9.8 R58.2
AVIN_2: P9.6 R60.2
AVIN_3: P9.4 R62.2
AVIN_4: P9.2 R64.2
AVIN_5: P8.4 R66.2
AVIN_6: P8.2 R68.2

### Library data of the parts
D2-D7 = Diode Zener 3.3V: Dán; Don_Vi: Con; Ma_Hang: MH002880; Ten_Linh_Kien: Diode Zener 1/2W 3.3V SMD1206 ZMM3.3; Kieu_Chan: *; Ghi_Chu: *; Chung_Loai: Dán
IC2-IC4 = LM358 SOP8: Dán; Ma_Hang: MH000609; Don_Vi: Con; Ten_Linh_Kien: LM358 SOP8; Kieu_Chan: *; Ghi_Chu: *; Chung_Loai: Dán
P8 = CON 4 EDG5.08: as P10 on sheet RS485; Don_Vi: Con; Ghi_Chu: *; Kieu_Chan: *; Chung_Loai: Cắm
P9 = CON 8 EDG5.08: as P3 on sheet D_INPUT; Don_Vi: Con; Ghi_Chu: *; Kieu_Chan: *; Chung_Loai: Cắm
R58 R60 R62 R64 R66 R68 = Tro 0805 5% 10k: as R6 on sheet PLC_V1.0; Chung_Loai: Dán; Kieu_Chan: *
R59 R61 R63 R65 R67 R69 = Tro 0805 5% 4.7k: Dán; Don_Vi: Con; So_Chan: 2; Ten_Linh_Kien: Trở 0805 5% 4.7k; Ma_Hang: MH005307; Chung_Loai: Dán; Kieu_Chan: *

## Sheet Regulator.SchDoc
size A; SheetNumber: 9; SheetTotal: 9
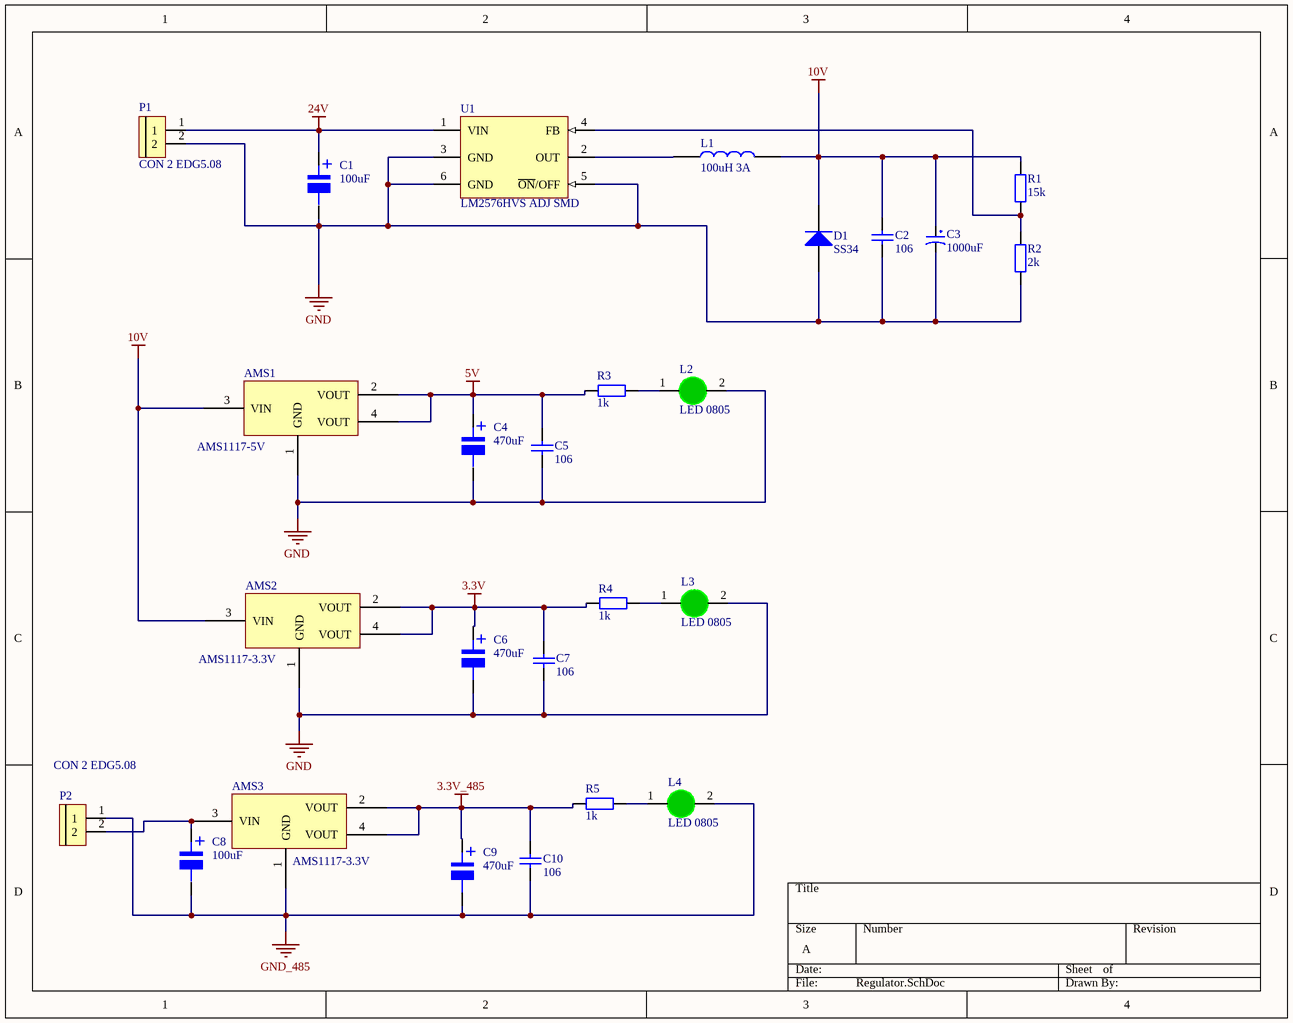
[diagram p7: Regulator.SchDoc]

### Parts
AMS1  AMS1117-5V  [SOT223]
AMS2  AMS1117-3.3V  [SOT223]
AMS3  AMS1117-3.3V  [SOT223]
C1  100uF  [tu nhom 8 (f)]
C2  106  [tu 0805]
C3  1000uF  [tu hoa 13mm]
C4  470uF  [tu nhom 10 (G)]
C5  106  [tu 0805]
C6  470uF  [tu nhom 10 (G)]
C7  106  [tu 0805]
C8  100uF  [tu nhom 8 (f)]
C9  470uF  [tu nhom 10 (G)]
C10  106  [tu 0805]
D1  SS34  [DIODE SMA]
L1  100uH 3A  [CUON CAM 100uH3A]
L2  LED 0805  [LED-0805-Green]
L3  LED 0805  [LED-0805-Green]
L4  LED 0805  [LED-0805-Green]
P1  CON 2 EDG5.08  [CON 2 2EDG5.08]
P2  CON 2 EDG5.08  [CON 2 2EDG5.08]
R1  15k  [tro smd 0805]
R2  2k  [tro smd 0805]
R3  1k  [tro smd 0805]
R4  1k  [tro smd 0805]
R5  1k  [tro smd 0805]
U1  LM2576HVS ADJ SMD  [TO263-5]

### Nets
3.3V: AMS2.2(VOUT) AMS2.4(VOUT) C6.1 C7.1 R4.1
3.3V_485: AMS3.2(VOUT) AMS3.4(VOUT) C9.1 C10.1 R5.1
5V: AMS1.2(VOUT) AMS1.4(VOUT) C4.1 C5.1 R3.1
10V: AMS1.3(VIN) AMS2.3(VIN) C2.1 C3.1 D1.2(K) L1.2 R1.1
24V: C1.1 P1.1 U1.1(VIN)
GND: AMS1.1(GND) AMS2.1(GND) C1.2 C2.2 C3.2 C4.2 C5.2 C6.2 C7.2 D1.1(A) L2.2(K) L3.2(K) P1.2 R2.1 U1.3(GND) U1.5(~{ON}/OFF) U1.6(GND)
GND_485: AMS3.1(GND) C8.2 C9.2 C10.2 L4.2(K) P2.1
NetAMS3_3: AMS3.3(VIN) C8.1 P2.2
NetL1_1: L1.1 U1.2(OUT)
NetL2_1: L2.1(A) R3.2
NetL3_1: L3.1(A) R4.2
NetL4_1: L4.1(A) R5.2
NetR1_2: R1.2 R2.2 U1.4(FB)

### Notes on the sheet
- (in symbol Tu Nhom 100uF 50V) +
- (in symbol Tu Nhom 470uF 35V) +

### Library data of the parts
AMS1-AMS3 = AMS1117 SMD: Dán; Value: AMS1117-3.3V SOT223; Don_Vi: Con; Ma_Hang: MH000596; Ghi_Chu: *; Kieu_Chan: *; Chung_Loai: Dán
C1 C8 = Tu Nhom 100uF 50V: Dán; Don_Vi: Con; So_Chan: 2; Ten_Linh_Kien: Tụ Nhôm 100uF 50V 8x10.2MM; Ma_Hang: MH002223; Chung_Loai: Dán; Kieu_Chan: *
C2 C5 C7 C10 = Tu 0805 106 16V 10%: Dán; Ten_Linh_Kien: Tụ 0805 106-10uF 10% 16V; So_Chan: 2; Don_Vi: Con; Ma_Hang: MH004553; Chung_Loai: Dán; Kieu_Chan: *
C3 = Tu Hoa 1000uF 25V 13x21: Cắm; Don_Vi: Con; So_Chan: 2; Ten_Linh_Kien: Tụ Hóa 1000uF 25V 13x21MM; Ma_Hang: MH002315; Chung_Loai: Cắm; Kieu_Chan: *
C4 C6 C9 = Tu Nhom 470uF 35V: Dán; Don_Vi: Con; So_Chan: 2; Ten_Linh_Kien: Tụ Nhôm 470uF 35V 10x10.5MM; Ma_Hang: MH004418; Chung_Loai: Dán; Kieu_Chan: *
D1 = Diode SS34 ( 1N5822 ): Dán; Don_Vi: Con; Ma_Hang: MH002104; Ten_Linh_Kien: Diode SS34 3A 40V SMA ( 1N5822 SS34A); Kieu_Chan: *; Chung_Loai: Dán
L1 = CUON CAM 100uH DIP: Dán; Don_Vi: Con; Ma_Hang: MH002209; Ten_Linh_Kien: Cuộn Cảm 100uH 3A 8x10MM; Chung_Loai: Dán; Ghi Chu: *; Kieu Chan: *
L2-L4 = LED 0805 Xanh La: Dán; Don_Vi: Con; Ma_Hang: MH002326; Ten_Linh_Kien: LED 0805 Màu Xanh Lá (Green); Ghi_Chu: *; Kieu_Chan: *; Chung_Loai: Dán
P1 P2 = CON 2 EDG5.08: Cắm; Ten_Linh_Kien: CON 2 2EDG5.08-2P 5.08MM ( Xanh Cong); Ma_Hang: MH000759; Ghi_Chu: *; Don_Vi: Con; Kieu_Chan: *; Chung_Loai: Cắm
R1 = Tro 0805 1% 15k: Dán; Don_Vi: Con; So_Chan: 2; Ten_Linh_Kien: Trở 0805 1% 15k; Ma_Hang: MH005476; Chung_Loai: Dán; Kieu_Chan: *
R2 = Tro 0805 1% 2k: Dán; Don_Vi: Con; So_Chan: 2; Ten_Linh_Kien: Trở 0805 1% 2k; Ma_Hang: MH005471; Chung_Loai: Dán; Kieu_Chan: *
R3-R5 = Tro 0805 5% 1k: Dán; Don_Vi: Con; So_Chan: 2; Ten_Linh_Kien: Trở 0805 5% 1k; Ma_Hang: MH005234; Chung_Loai: Dán; Kieu_Chan: *
U1 = LM2576HVS ADJ SMD: Dán; Ten_Linh_Kien: LM2576HVS-ADJ BUCK ADJ 3A TO263-5; Don_Vi: Con; Ma_Hang: MH002361; Ghi_Chu: *; Kieu_Chan: *; Chung_Loai: Dán

## Sheet RS232.SchDoc
size A; SheetNumber: 6; SheetTotal: 9
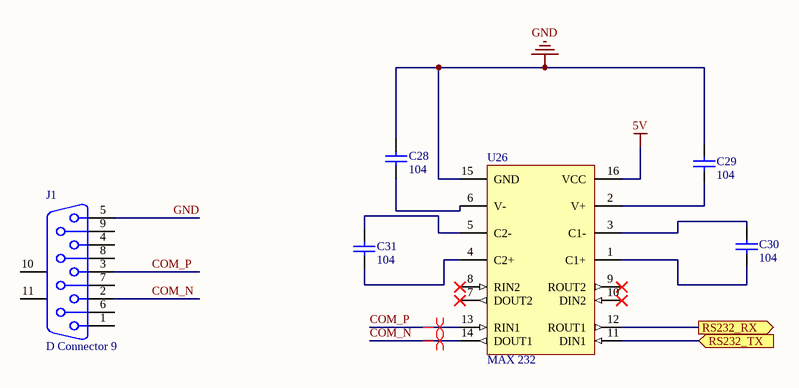
[diagram p8: RS232.SchDoc]

### Parts
C28  104  [tu 0805]
C29  104  [tu 0805]
C30  104  [tu 0805]
C31  104  [tu 0805]
J1  D Connector 9  [DSUB1.385-2H9]
U26  MAX 232  [SOIC-16]

### Ports
RS232_RX (out), RS232_TX (in)

### Nets
5V: U26.16(VCC)
GND: C28.2 C29.2 J1.5 U26.15(GND)
COM_N: J1.2 U26.14(DOUT1)
COM_P: J1.3 U26.13(RIN1)
UART1_N: U26.11(DIN1) ; port RS232_TX
UART1_P: U26.12(ROUT1) ; port RS232_RX
NetC28_1: C28.1 U26.6(V-)
NetC29_1: C29.1 U26.2(V+)
NetC30_1: C30.1 U26.3(C1-)
NetC30_2: C30.2 U26.1(C1+)
NetC31_1: C31.1 U26.5(C2-)
NetC31_2: C31.2 U26.4(C2+)

Not connected (* = marked no-connect by the designer): J1 1 4 6 7 8 9 10(MH1) 11(MH2); U26 7(DOUT2)* 8(RIN2)* 9(ROUT2)* 10(DIN2)*

### Layout directives
differential pair: COM_N, COM_P

### Library data of the parts
C28-C31 = Tu 0805 104 50V 10%: as C27 on sheet PLC_V1.0; Chung_Loai: Dán; Kieu_Chan: *
J1 = DB9_RA: Receptacle Assembly, 9 Position, Right Angle; PackageDocument: O; Positions: 9; Published: 15-Jun-2001; LatestRevisionDate: 17-Jul-2002; LatestRevisionNote: Re-released for DXP Platform.; DatasheetDocument: 1-Sep-1999; PackageReference: 788750; Publisher: Altium Limited; Orientation: Right Angle; Gender: Receptacle
U26 = MAX3232CDRE4, MAX3232CDR: IC DRVR/RCVR MULTCH RS232 16SOIC; Solder: SMT; MPN: MAX3232CDRE4, MAX3232CDR; Value: MAX 232; Category: IC

## Nets that join several sheets
3.3V: PLC_V1.0 (23 pins), RS485 (5 pins), D_INPUT (13 pins), ESP32 (9 pins), A_INPUT (IC2.8 IC3.8 IC4.8), Regulator (5 pins)
3.3V_485: RS485 (7 pins), Regulator (5 pins)
5V: ESP32 (D8.C), Regulator (5 pins), RS232 (U26.16)
10V: PWM_OUTPUT (IC1.8), Regulator (7 pins)
24V: D_OUTPUT (20 pins), Regulator (C1.1 P1.1 U1.1)
GND: PLC_V1.0 (28 pins), D_OUTPUT (10 pins), RS485 (6 pins), D_INPUT (13 pins), ESP32 (19 pins), PWM_OUTPUT (5 pins), A_INPUT (21 pins), Regulator (17 pins), RS232 (C28.2 C29.2 J1.5 U26.15)
GND_485: RS485 (C36.2 C37.2 C38.2 C39.2), Regulator (6 pins)
GND_CL: D_OUTPUT (10 pins), D_INPUT (13 pins)
AI_1: PLC_V1.0 (U2.24), A_INPUT (IC2.1 IC2.2)
AI_2: PLC_V1.0 (U2.25), A_INPUT (IC2.6 IC2.7)
AI_3: PLC_V1.0 (U2.26), A_INPUT (IC3.1 IC3.2)
AI_4: PLC_V1.0 (U2.29), A_INPUT (IC3.6 IC3.7)
AI_5: PLC_V1.0 (U2.30), A_INPUT (IC4.1 IC4.2)
AI_6: PLC_V1.0 (U2.31), A_INPUT (IC4.6 IC4.7)
DE: PLC_V1.0 (U2.66), RS485 (U27.5)
DI_1: PLC_V1.0 (U2.46), D_INPUT (R8.1 U3.4)
DI_2: PLC_V1.0 (U2.45), D_INPUT (R13.1 U6.4)
DI_3: PLC_V1.0 (U2.44), D_INPUT (R17.1 U8.4)
DI_4: PLC_V1.0 (U2.43), D_INPUT (R21.1 U10.4)
DI_5: PLC_V1.0 (U2.41), D_INPUT (R25.1 U12.4)
DI_6: PLC_V1.0 (U2.39), D_INPUT (R29.1 U14.4)
DI_7: PLC_V1.0 (U2.38), D_INPUT (R9.1 U4.4)
DI_8: PLC_V1.0 (U2.37), D_INPUT (R12.1 U5.4)
DI_9: PLC_V1.0 (U2.36), D_INPUT (R16.1 U7.4)
DI_10: PLC_V1.0 (U2.35), D_INPUT (R20.1 U9.4)
DI_11: PLC_V1.0 (U2.34), D_INPUT (R24.1 U11.4)
DI_12: PLC_V1.0 (U2.33), D_INPUT (R28.1 U13.4)
DI_13: PLC_V1.0 (U2.32), D_INPUT (R32.1 U15.4)
DO_1: PLC_V1.0 (U2.98), D_OUTPUT (R35.1)
DO_2: PLC_V1.0 (U2.97), D_OUTPUT (R39.1)
DO_3: PLC_V1.0 (U2.96), D_OUTPUT (R43.1)
DO_4: PLC_V1.0 (U2.95), D_OUTPUT (R46.1)
DO_5: PLC_V1.0 (U2.93), D_OUTPUT (R49.1)
DO_6: PLC_V1.0 (U2.92), D_OUTPUT (R53.1)
DO_7: PLC_V1.0 (U2.91), D_OUTPUT (R38.1)
DO_8: PLC_V1.0 (U2.90), D_OUTPUT (R42.1)
DO_9: PLC_V1.0 (U2.89), D_OUTPUT (R47.1)
DO_10: PLC_V1.0 (U2.88), D_OUTPUT (R51.1)
RE: PLC_V1.0 (U2.67), RS485 (U27.4)
TM1_PWR_CH1: PLC_V1.0 (U2.40), PWM_OUTPUT (IC1.3)
TM1_PWR_CH2: PLC_V1.0 (U2.42), PWM_OUTPUT (IC1.5)
UART1_N: PLC_V1.0 (U2.68), RS232 (U26.11)
UART1_P: PLC_V1.0 (U2.69), RS232 (U26.12)
UART4_N: PLC_V1.0 (U2.78), RS485 (U27.6)
UART4_P: PLC_V1.0 (U2.79), RS485 (U27.3)
UART5_N: PLC_V1.0 (U2.80), ESP32 (*1.27)
UART5_P: PLC_V1.0 (U2.83), ESP32 (*1.28)